# Altium schematic sheet Output_Registers.SchDoc
size A3; SheetNumber: 8; SheetTotal: 9
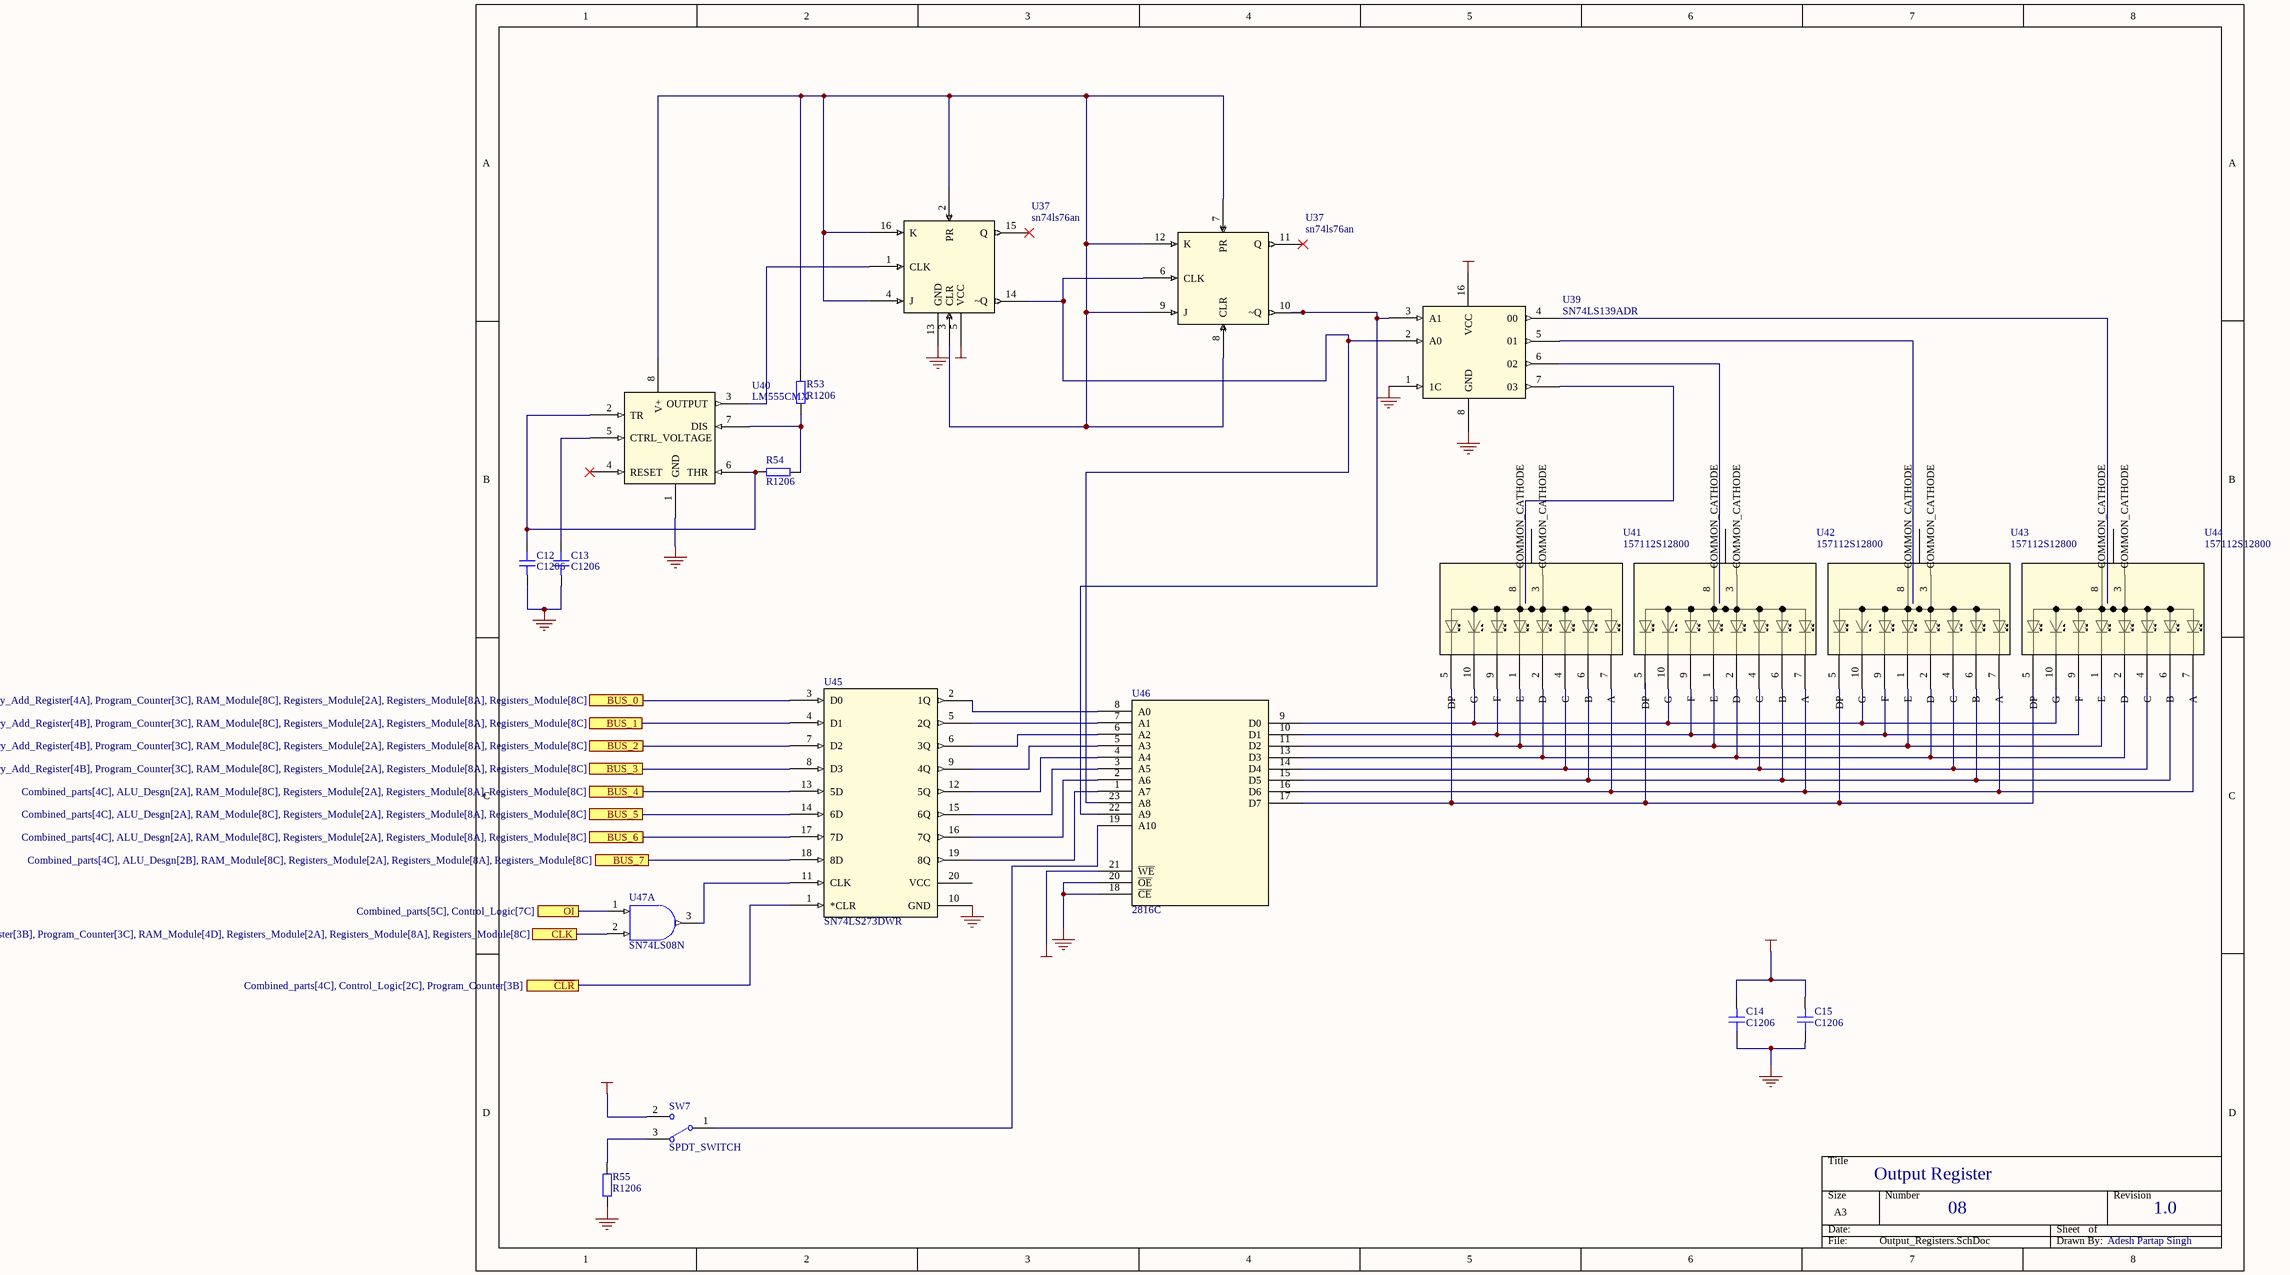
[diagram p0: Output_Registers.SchDoc]

## Parts
(Parts that share a designator on the sheet are numbered #1, #2 ... from top to bottom, then left to right.)
C12  C1206  [CAP_1206]
C13  C1206  [CAP_1206]
C14  C1206  [CAP_1206]
C15  C1206  [CAP_1206]
R53  R1206  [RES_1206]
R54  R1206  [RES_1206]
R55  R1206  [RES_1206]
SW7  SPDT_SWITCH  [EOZ-09.03201.02-3]
U37#1  sn74ls76an  [N16]
U37#2  sn74ls76an  [N16]
U39  SN74LS139ADR  [D16]
U40  LM555CMX  [SOIC-8_ONS]
U41  157112S12800  [WL-S7DS_WRE]
U42  157112S12800  [WL-S7DS_WRE]
U43  157112S12800  [WL-S7DS_WRE]
U44  157112S12800  [WL-S7DS_WRE]
U45  SN74LS273DWR  [DW20]
U46  2816C  [28P6_ATM]
U47  SN74LS08N  [N0014A]  (part A of 5)

## Ports
BUS_0 (see Combined_parts[4C], ALU_Desgn[2A], Memory_Add_Register[4A], Program_Counter[3C], RAM_Module[8C], Registers_Module[2A], Registers_Module[8A], Registers_Module[8C]), BUS_1 (see Combined_parts[4C], ALU_Desgn[2A], Memory_Add_Register[4B], Program_Counter[3C], RAM_Module[8C], Registers_Module[2A], Registers_Module[8A], Registers_Module[8C]), BUS_2 (see Combined_parts[4C], ALU_Desgn[2A], Memory_Add_Register[4B], Program_Counter[3C], RAM_Module[8C], Registers_Module[2A], Registers_Module[8A], Registers_Module[8C]), BUS_3 (see Combined_parts[4C], ALU_Desgn[2A], Memory_Add_Register[4B], Program_Counter[3C], RAM_Module[8C], Registers_Module[2A], Registers_Module[8A], Registers_Module[8C]), BUS_4 (see Combined_parts[4C], ALU_Desgn[2A], RAM_Module[8C], Registers_Module[2A], Registers_Module[8A], Registers_Module[8C]), BUS_5 (see Combined_parts[4C], ALU_Desgn[2A], RAM_Module[8C], Registers_Module[2A], Registers_Module[8A], Registers_Module[8C]), BUS_6 (see Combined_parts[4C], ALU_Desgn[2A], RAM_Module[8C], Registers_Module[2A], Registers_Module[8A], Registers_Module[8C]), BUS_7 (see Combined_parts[4C], ALU_Desgn[2B], RAM_Module[8C], Registers_Module[2A], Registers_Module[8A], Registers_Module[8C]), CLK (see Combined_parts[4C], ALU_Desgn[1C], Clock_module[4C], Memory_Add_Register[3B], Program_Counter[3C], RAM_Module[4D], Registers_Module[2A], Registers_Module[8A], Registers_Module[8C]), OI (see Combined_parts[5C], Control_Logic[7C]), ~{CLR} (see Combined_parts[4C], Control_Logic[2C], Program_Counter[3B])

## Nets
GND: C12.1 C13.1 C14.2 C15.2 R55.1 U37#1.13(GND) U39.1(1C) U39.8(GND) U40.1(GND) U45.10(GND) U46.18(~{CE}) U46.20(~{OE})
VCC: C14.1 C15.1 SW7.2 U37#1.5(VCC) U39.16(VCC) U46.21(~{WE})
BUS_0: U45.3(D0) ; port BUS_0
BUS_1: U45.4(D1) ; port BUS_1
BUS_2: U45.7(D2) ; port BUS_2
BUS_3: U45.8(D3) ; port BUS_3
BUS_4: U45.13(5D) ; port BUS_4
BUS_5: U45.14(6D) ; port BUS_5
BUS_6: U45.17(7D) ; port BUS_6
BUS_7: U45.18(8D) ; port BUS_7
~{CLR}: U45.1(*CLR) ; port ~{CLR}
CLK: U47.2(1B) ; port CLK
OI: U47.1(1A) ; port OI
NetC12_2: C12.2 R54.1 U40.2(TR) U40.6(THR)
NetC13_2: C13.2 U40.5(CTRL_VOLTAGE)
NetR53_1: R53.1 R54.2 U40.7(DIS)
NetR53_2: R53.2 U37#1.2(PR) U37#1.3(CLR) U37#1.4(J) U37#1.16(K) U37#2.7(PR) U37#2.8(CLR) U37#2.9(J) U37#2.12(K) U40.8(V+)
NetR55_2: R55.2 SW7.3
NetSW7_1: SW7.1 U46.19(A10)
NetU37#1_1: U37#1.1(CLK) U40.3(OUTPUT)
NetU37#1_14: U37#1.14(~Q) U37#2.6(CLK) U39.2(A0) U46.23(A8)
NetU37#2_10: U37#2.10(~Q) U39.3(A1) U46.22(A9)
NetU45_2: U45.2(1Q) U46.8(A0)
NetU45_5: U45.5(2Q) U46.7(A1)
NetU45_6: U45.6(3Q) U46.6(A2)
NetU45_9: U45.9(4Q) U46.5(A3)
NetU45_11: U45.11(CLK) U47.3(1Y)
NetU45_12: U45.12(5Q) U46.4(A4)
NetU45_15: U45.15(6Q) U46.3(A5)
NetU45_16: U45.16(7Q) U46.2(A6)
NetU45_19: U45.19(8Q) U46.1(A7)

Not connected (* = marked no-connect by the designer): U37#1 15(Q)*; U37#2 11(Q)*; U39 4(00) 5(01) 6(02) 7(03); U40 4(RESET)*; U41 1(E) 2(D) 3(COMMON_CATHODE) 4(C) 5(DP) 6(B) 7(A) 8(COMMON_CATHODE) 9(F) 10(G); U42 1(E) 2(D) 3(COMMON_CATHODE) 4(C) 5(DP) 6(B) 7(A) 8(COMMON_CATHODE) 9(F) 10(G); U43 1(E) 2(D) 3(COMMON_CATHODE) 4(C) 5(DP) 6(B) 7(A) 8(COMMON_CATHODE) 9(F) 10(G); U44 1(E) 2(D) 3(COMMON_CATHODE) 4(C) 5(DP) 6(B) 7(A) 8(COMMON_CATHODE) 9(F) 10(G); U45 20(VCC); U46 9(D0) 10(D1) 11(D2) 13(D3) 14(D4) 15(D5) 16(D6) 17(D7)

## Notes on the sheet
- Output Register
- 08
- 1.0
- Adesh Partap Singh

## Library data of the parts
C12-C15 = CAP_1206: Capacitor SMD 1206; Manufacturer: *; Manufacturer Part Number: *; Distributor Link: *; LCSC: *; Rating: *; Dielectric: *
R53-R55 = RES_1206: Resistor SMD 1206; Manufacturer: *; Manufacturer Part Number: *; Distributor Link: *; LCSC: *
SW7 = SWITCH_SPDT
U37#1 = SN74LS76: Dual JK FlipFlop; Mfr_Name: Texas Instruments; Copyright: Copyright (C) 2023 Ultra Librarian. All rights reserved.; Manufacturer_Part_Number: sn74ls76an; Digi-Key_Part_Number_1: SN74LS76AN-ND; RefDes: RefDes; Type: DEV
U37#2 = SN74LS76_1: Dual JK FlipFlop; Mfr_Name: Texas Instruments; Copyright: Copyright (C) 2023 Ultra Librarian. All rights reserved.; Manufacturer_Part_Number: sn74ls76an; Digi-Key_Part_Number_1: SN74LS76AN-ND; RefDes: RefDes; Type: DEV
U39 = SN74LS139ADR: Decoder/Demultiplexer 1 x 2:4 16-SOIC; Mfr_Name: Texas Instruments; Copyright: Copyright (C) 2023 Ultra Librarian. All rights reserved.; Manufacturer_Part_Number: SN74LS139ADR; RefDes: RefDes; Type: DEV
U40 = LM555CMX: No Description Available; Mfr_Name: onsemi; Copyright: Copyright (C) 2023 Ultra Librarian. All rights reserved.; Manufacturer_Part_Number: LM555CMX; RefDes: RefDes; Type: DEV
U41-U44 = 157112S12800: 7 sEGMENT dISPLAY; Mfr_Name: Wurth Electronics; Copyright: Copyright (C) 2023 Ultra Librarian. All rights reserved.; Manufacturer_Part_Number: 157112S12800; RefDes: RefDes; Type: DEV
U45 = SN74LS273DWR: Flip Flop 1 Element D-Type 8 Bit Positive Edge 20-SOIC (0.209", 5.30mm Width); Mfr_Name: Texas Instruments; Copyright: Copyright (C) 2023 Ultra Librarian. All rights reserved.; Manufacturer_Part_Number: SN74LS273DWR; RefDes: RefDes; Type: DEV
U46 = 2816C: EEPROM Memory IC 64Kbit Parallel 150 ns 28-PDIP; Mfr_Name: Texas Instruments; Manufacturer_Part_Number: SN74LS273DWR; Copyright: Copyright (C) 2023 Ultra Librarian. All rights reserved.; RefDes: RefDes; Type: DEV
U47 = CMP-0777-00259-3: Quadruple 2-Input Positive-AND Gates, N0014A, TUBE; Manufacturer: Texas Instruments; VCC(Max)(V): 5.25; ICC @ Nom Voltage(Max)(mA): 0.021; VCC(Min)(V): 4.75; tpd @ Nom Voltage(Max)(ns): 25; Rating: Catalog; Output Type: TTL; Bits(#): 4; Schmitt Trigger: No; Voltage(Nom)(V): 5; Technology Family: LS; F @ Nom Voltage(Max)(Mhz): 35; Output Drive (IOL/IOH)(Max)(mA): -0.8/16; PackageReference: N0014A; DatasheetVersion: SDLS033; Input Type: TTL; Operating Temperature Range(C): 0 to 70; Generic Part Number: SN74LS08